# Altium project PCBFLEX.PrjPcb
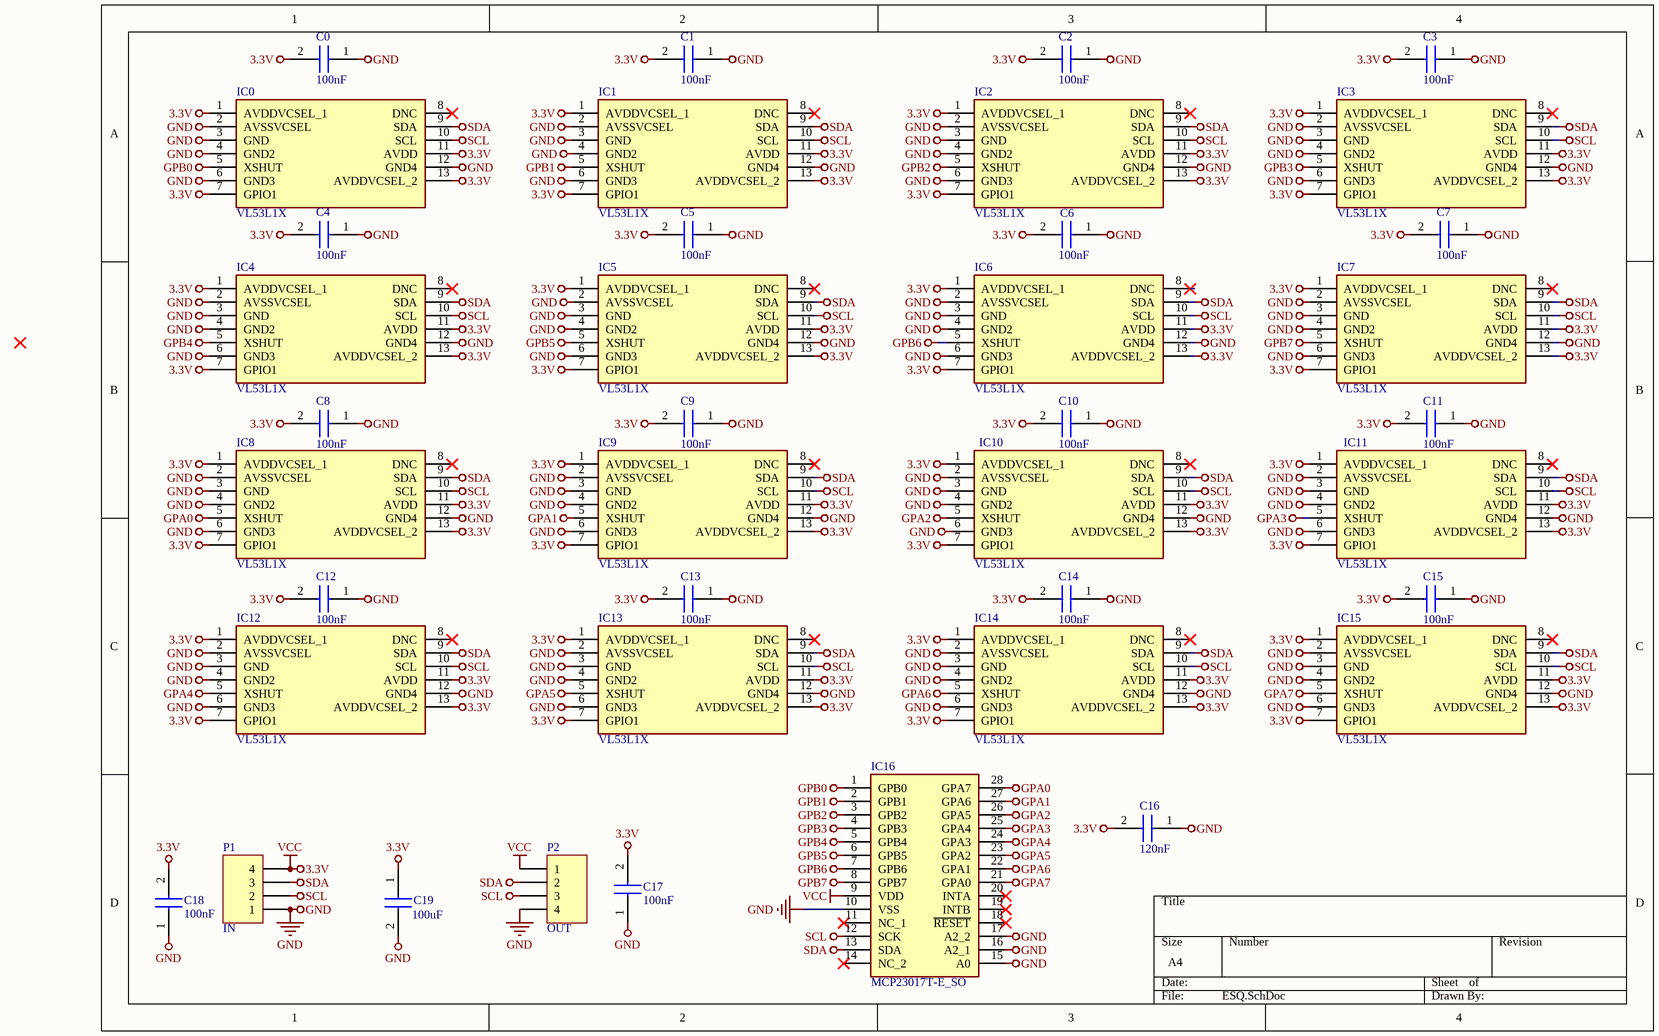
[diagram p0: ESQ.SchDoc]
1 sheet, 39 parts. Net scope: global (net labels, ports and power ports of the same name join across sheets).
Board file: PCB.PcbDoc

## Sheet ESQ.SchDoc
size A4; SheetNumber: 1; SheetTotal: 1

### Parts
C0  100nF  [CAPC1608X90N]
C1  100nF  [CAPC1608X90N]
C2  100nF  [CAPC1608X90N]
C3  100nF  [CAPC1608X90N]
C4  100nF  [CAPC1608X90N]
C5  100nF  [CAPC1608X90N]
C6  100nF  [CAPC1608X90N]
C7  100nF  [CAPC1608X90N]
C8  100nF  [CAPC1608X90N]
C9  100nF  [CAPC1608X90N]
C10  100nF  [CAPC1608X90N]
C11  100nF  [CAPC1608X90N]
C12  100nF  [CAPC1608X90N]
C13  100nF  [CAPC1608X90N]
C14  100nF  [CAPC1608X90N]
C15  100nF  [CAPC1608X90N]
C16  120nF  [CAPC1608X90N]
C17  100nF  [CAPC1608X90N]
C18  100nF  [CAPC1608X90N]
C19  100uF  [CAPC1608X90N]
IC0  VL53L1X  [VL53L1X]
IC1  VL53L1X  [VL53L1X]
IC2  VL53L1X  [VL53L1X]
IC3  VL53L1X  [VL53L1X]
IC4  VL53L1X  [VL53L1X]
IC5  VL53L1X  [VL53L1X]
IC6  VL53L1X  [VL53L1X]
IC7  VL53L1X  [VL53L1X]
IC8  VL53L1X  [VL53L1X]
IC9  VL53L1X  [VL53L1X]
IC10  VL53L1X  [VL53L1X]
IC11  VL53L1X  [VL53L1X]
IC12  VL53L1X  [VL53L1X]
IC13  VL53L1X  [VL53L1X]
IC14  VL53L1X  [VL53L1X]
IC15  VL53L1X  [VL53L1X]
IC16  MCP23017T-E_SO  [SOIC127P1030X265-28N]
P1  IN  [HDR1X4]
P2  OUT  [HDR1X4]

### Nets
3.3V: C0.2 C1.2 C2.2 C3.2 C4.2 C5.2 C6.2 C7.2 C8.2 C9.2 C10.2 C11.2 C12.2 C13.2 C14.2 C15.2 C16.2 C17.2 C18.2 C19.1 IC0.1(AVDDVCSEL_1) IC0.7(GPIO1) IC0.11(AVDD) IC0.13(AVDDVCSEL_2) IC1.1(AVDDVCSEL_1) IC1.7(GPIO1) IC1.11(AVDD) IC1.13(AVDDVCSEL_2) IC2.1(AVDDVCSEL_1) IC2.7(GPIO1) IC2.11(AVDD) IC2.13(AVDDVCSEL_2) IC3.1(AVDDVCSEL_1) IC3.7(GPIO1) IC3.11(AVDD) IC3.13(AVDDVCSEL_2) IC4.1(AVDDVCSEL_1) IC4.7(GPIO1) IC4.11(AVDD) IC4.13(AVDDVCSEL_2) IC5.1(AVDDVCSEL_1) IC5.7(GPIO1) IC5.11(AVDD) IC5.13(AVDDVCSEL_2) IC6.1(AVDDVCSEL_1) IC6.7(GPIO1) IC6.11(AVDD) IC6.13(AVDDVCSEL_2) IC7.1(AVDDVCSEL_1) IC7.7(GPIO1) IC7.11(AVDD) IC7.13(AVDDVCSEL_2) IC8.1(AVDDVCSEL_1) IC8.7(GPIO1) IC8.11(AVDD) IC8.13(AVDDVCSEL_2) IC9.1(AVDDVCSEL_1) IC9.7(GPIO1) IC9.11(AVDD) IC9.13(AVDDVCSEL_2) IC10.1(AVDDVCSEL_1) IC10.7(GPIO1) IC10.11(AVDD) IC10.13(AVDDVCSEL_2) IC11.1(AVDDVCSEL_1) IC11.7(GPIO1) IC11.11(AVDD) IC11.13(AVDDVCSEL_2) IC12.1(AVDDVCSEL_1) IC12.7(GPIO1) IC12.11(AVDD) IC12.13(AVDDVCSEL_2) IC13.1(AVDDVCSEL_1) IC13.7(GPIO1) IC13.11(AVDD) IC13.13(AVDDVCSEL_2) IC14.1(AVDDVCSEL_1) IC14.7(GPIO1) IC14.11(AVDD) IC14.13(AVDDVCSEL_2) IC15.1(AVDDVCSEL_1) IC15.7(GPIO1) IC15.11(AVDD) IC15.13(AVDDVCSEL_2) IC16.9(VDD) P1.4 P2.1  [also labelled VCC]
GND: C0.1 C1.1 C2.1 C3.1 C4.1 C5.1 C6.1 C7.1 C8.1 C9.1 C10.1 C11.1 C12.1 C13.1 C14.1 C15.1 C16.1 C17.1 C18.1 C19.2 IC0.2(AVSSVCSEL) IC0.3(GND) IC0.4(GND2) IC0.6(GND3) IC0.12(GND4) IC1.2(AVSSVCSEL) IC1.3(GND) IC1.6(GND3) IC1.12(GND4) IC2.2(AVSSVCSEL) IC2.3(GND) IC2.4(GND2) IC2.6(GND3) IC2.12(GND4) IC3.2(AVSSVCSEL) IC3.3(GND) IC3.4(GND2) IC3.6(GND3) IC3.12(GND4) IC4.2(AVSSVCSEL) IC4.3(GND) IC4.4(GND2) IC4.6(GND3) IC4.12(GND4) IC5.3(GND) IC5.4(GND2) IC5.6(GND3) IC5.12(GND4) IC6.2(AVSSVCSEL) IC6.3(GND) IC6.4(GND2) IC6.6(GND3) IC6.12(GND4) IC7.2(AVSSVCSEL) IC7.3(GND) IC7.4(GND2) IC7.6(GND3) IC7.12(GND4) IC8.2(AVSSVCSEL) IC8.3(GND) IC8.4(GND2) IC8.6(GND3) IC8.12(GND4) IC9.2(AVSSVCSEL) IC9.3(GND) IC9.4(GND2) IC9.6(GND3) IC9.12(GND4) IC10.2(AVSSVCSEL) IC10.3(GND) IC10.4(GND2) IC10.12(GND4) IC11.2(AVSSVCSEL) IC11.3(GND) IC11.4(GND2) IC11.6(GND3) IC11.12(GND4) IC12.2(AVSSVCSEL) IC12.3(GND) IC12.4(GND2) IC12.6(GND3) IC12.12(GND4) IC13.2(AVSSVCSEL) IC13.3(GND) IC13.4(GND2) IC13.6(GND3) IC13.12(GND4) IC14.2(AVSSVCSEL) IC14.3(GND) IC14.4(GND2) IC14.6(GND3) IC14.12(GND4) IC15.2(AVSSVCSEL) IC15.3(GND) IC15.4(GND2) IC15.6(GND3) IC15.12(GND4) IC16.10(VSS) IC16.15(A0) IC16.16(A2_1) IC16.17(A2_2) P1.1 P2.4
GPA0: IC8.5(XSHUT) IC16.28(GPA7)
GPA1: IC16.27(GPA6)
GPA2: IC10.5(XSHUT) IC16.26(GPA5)
GPA3: IC11.5(XSHUT) IC16.25(GPA4)
GPA4: IC12.5(XSHUT) IC16.24(GPA3)
GPA5: IC13.5(XSHUT) IC16.23(GPA2)
GPA6: IC14.5(XSHUT) IC16.22(GPA1)
GPA7: IC15.5(XSHUT) IC16.21(GPA0)
GPB0: IC0.5(XSHUT) IC16.1(GPB0)
GPB1: IC1.5(XSHUT) IC16.2(GPB1)
GPB2: IC2.5(XSHUT) IC16.3(GPB2)
GPB3: IC3.5(XSHUT) IC16.4(GPB3)
GPB4: IC4.5(XSHUT) IC16.5(GPB4)
GPB5: IC5.5(XSHUT) IC16.6(GPB5)
GPB6: IC6.5(XSHUT) IC16.7(GPB6)
GPB7: IC7.5(XSHUT) IC16.8(GPB7)
SCL: IC0.10(SCL) IC1.10(SCL) IC2.10(SCL) IC3.10(SCL) IC4.10(SCL) IC5.10(SCL) IC6.10(SCL) IC7.10(SCL) IC8.10(SCL) IC9.10(SCL) IC10.10(SCL) IC11.10(SCL) IC12.10(SCL) IC13.10(SCL) IC14.10(SCL) IC15.10(SCL) IC16.12(SCK) P1.2 P2.3
SDA: IC0.9(SDA) IC1.9(SDA) IC2.9(SDA) IC3.9(SDA) IC4.9(SDA) IC5.9(SDA) IC6.9(SDA) IC7.9(SDA) IC8.9(SDA) IC9.9(SDA) IC10.9(SDA) IC11.9(SDA) IC12.9(SDA) IC13.9(SDA) IC14.9(SDA) IC15.9(SDA) IC16.13(SDA) P1.3 P2.2

Not connected (* = marked no-connect by the designer): IC0 8(DNC)*; IC1 4(GND2) 8(DNC)*; IC2 8(DNC)*; IC3 8(DNC)*; IC4 8(DNC)*; IC5 2(AVSSVCSEL) 8(DNC)*; IC6 8(DNC)*; IC7 8(DNC)*; IC8 8(DNC)*; IC9 5(XSHUT) 8(DNC)*; IC10 6(GND3) 8(DNC)*; IC11 8(DNC)*; IC12 8(DNC)*; IC13 8(DNC)*; IC14 8(DNC)*; IC15 8(DNC)*; IC16 11(NC_1)* 14(NC_2)* 18(~{RESET})* 19(INTB)* 20(INTA)*

### Notes on the sheet
- Labels drawn without touching a wire or pin: GND, GPA1

### Library data of the parts
C0-C18 = 0603YC104K4T2A: Capacitor; Manufacturer_Name: Kyocera AVX; Datasheet Link: https://componentsearchengine.com/Datasheets/1/06031A100FAT2A.pdf; Height: 0.9mm; Manufacturer_Part_Number: 0603YC104K4T2A; Mouser Part Number: 581-0603YC104K4; Mouser Price/Stock: https://www.mouser.co.uk/ProductDetail/AVX/0603YC104K4T2A/?qs=Cej1j9ztgjHj4I01NaBI3A%3D%3D; Arrow Part Number: 0603YC104K4T2A; Arrow Price/Stock: https://www.arrow.com/en/products/0603yc104k4t2a/avx
C19 = 06033C474MAT2A: Capacitor; Manufacturer_Name: Kyocera AVX; Datasheet Link: https://componentsearchengine.com/Datasheets/1/06031A100FAT2A.pdf; Height: 0.9mm; Manufacturer_Part_Number: 06033C474MAT2A; Mouser Part Number: 581-06033C474MAT2A; Mouser Price/Stock: https://www.mouser.com/Search/Refine.aspx?Keyword=581-06033C474MAT2A
IC0-IC15 = VL53L1X: Integrated Circuit; Manufacturer_Name: STMicroelectronics; Datasheet Link: https://www.st.com/resource/en/datasheet/vl53l1x.pdf; Height: 1.6mm; Manufacturer_Part_Number: VL53L1X
IC16 = MCP23017T-E_SO: Integrated Circuit; Manufacturer_Name: Microchip; Manufacturer_Part_Number: MCP23017T-E/SO; Datasheet Link: http://ww1.microchip.com/downloads/en/DeviceDoc/20001952C.pdf; Height: 2.65mm; Mouser Part Number: 579-MCP23017T-E/SO; Mouser Price/Stock: https://www.mouser.co.uk/ProductDetail/Microchip-Technology/MCP23017T-E-SO?qs=usxtMOJb1RylPfT%252BJtgE3Q%3D%3D; Arrow Part Number: MCP23017T-E/SO; Arrow Price/Stock: https://www.arrow.com/en/products/mcp23017t-eso/microchip-technology?region=nac
P1 P2 = Header 4: Header, 4-Pin; LatestRevisionDate: 17-Jul-2002; LatestRevisionNote: Re-released for DXP Platform.; Publisher: Altium Limited